# Altium project main.PrjPCB
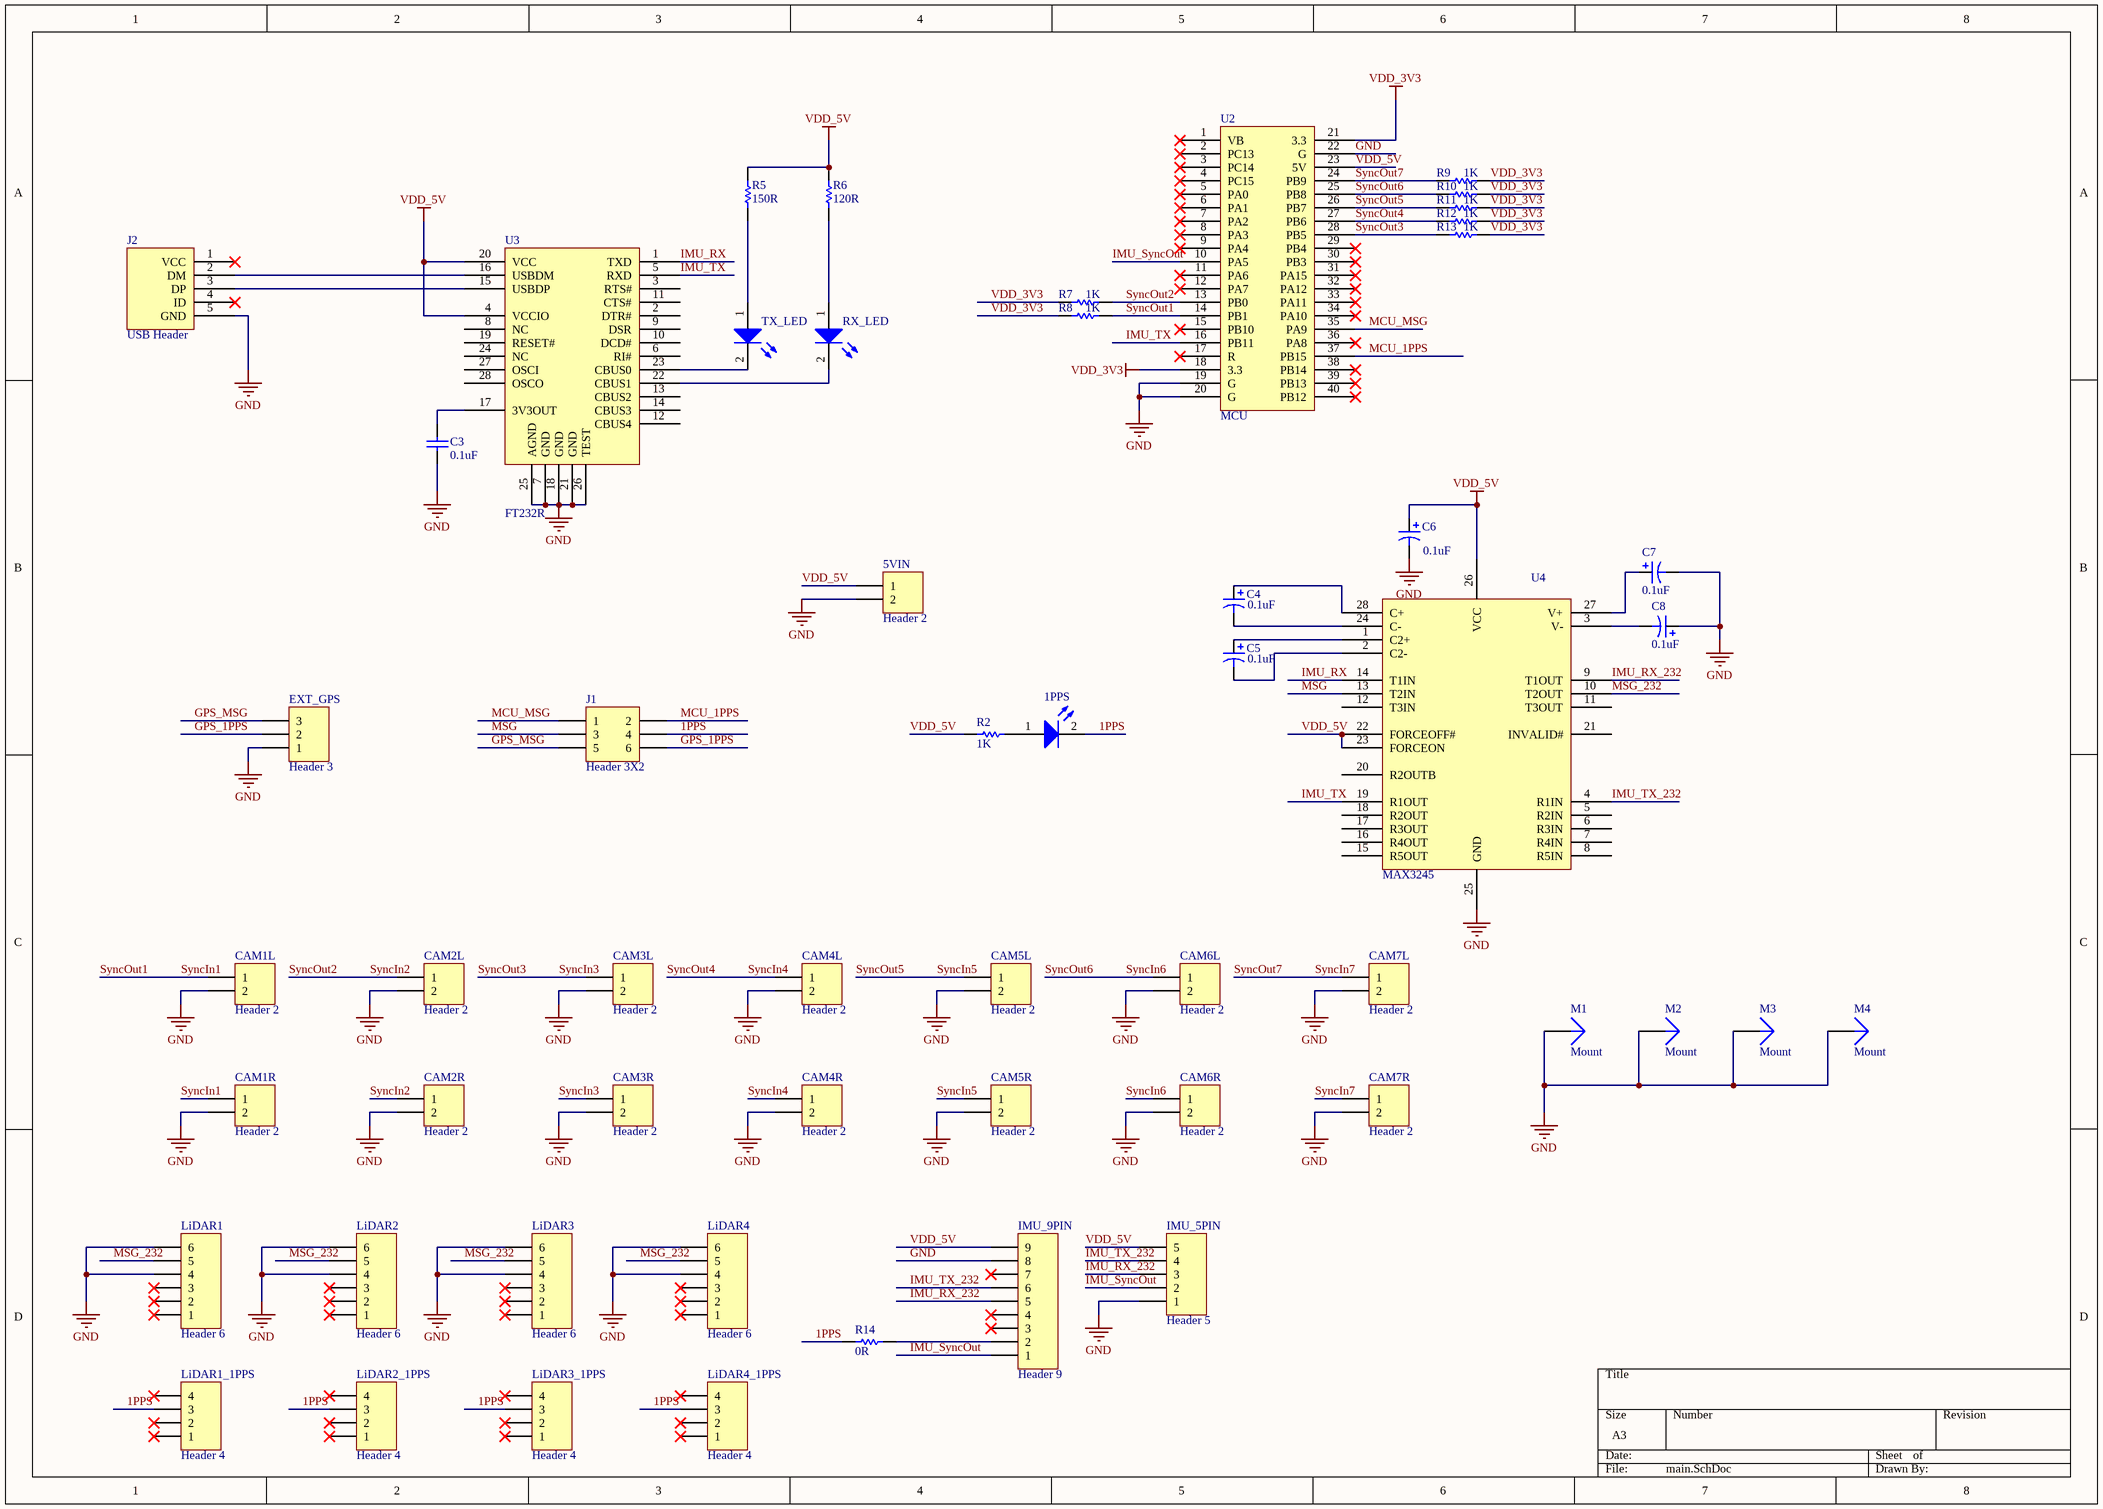
[diagram p0: main.SchDoc]
1 sheet, 55 parts. Net scope: global (net labels, ports and power ports of the same name join across sheets).
Board file: main.PcbDoc

## Sheet main.SchDoc
size A3

### Parts
1PPS  1PPS LED  [0805D]  (value not drawn)
5VIN  Header 2  [HDR1X2]
C3  0.1uF  [0805C]
C4  0.1uF  [C1206]
C5  0.1uF  [C1206]
C6  0.1uF  [C1206]
C7  0.1uF  [C1206]
C8  0.1uF  [C1206]
CAM1L  Header 2  [1.25mmP2]
CAM1R  Header 2  [1.25mmP2]
CAM2L  Header 2  [1.25mmP2]
CAM2R  Header 2  [1.25mmP2]
CAM3L  Header 2  [1.25mmP2]
CAM3R  Header 2  [1.25mmP2]
CAM4L  Header 2  [1.25mmP2]
CAM4R  Header 2  [1.25mmP2]
CAM5L  Header 2  [1.25mmP2]
CAM5R  Header 2  [1.25mmP2]
CAM6L  Header 2  [1.25mmP2]
CAM6R  Header 2  [1.25mmP2]
CAM7L  Header 2  [1.25mmP2]
CAM7R  Header 2  [1.25mmP2]
EXT_GPS  Header 3  [1.25mmP3]
IMU_5PIN  Header 5  [1.25mmP5]
IMU_9PIN  Header 9  [1.25mmP9]
J1  Header 3X2  [HDR2X3]
J2  USB Header  [USB2.5-2H4D]
LiDAR1  Header 6  [1.25mmP6]
LiDAR1_1PPS  Header 4  [1.25mmP4]
LiDAR2  Header 6  [1.25mmP6]
LiDAR2_1PPS  Header 4  [1.25mmP4]
LiDAR3  Header 6  [1.25mmP6]
LiDAR3_1PPS  Header 4  [1.25mmP4]
LiDAR4  Header 6  [1.25mmP6]
LiDAR4_1PPS  Header 4  [1.25mmP4]
M1  Mount  [安装孔-3.5-5]
M2  Mount  [安装孔-3.5-5]
M3  Mount  [安装孔-3.5-5]
M4  Mount  [安装孔-3.5-5]
R2  1K  [0805R]
R5  150R  [0805R]
R6  120R  [0805R]
R7  1K  [0805R]
R8  1K  [0805R]
R9  1K  [0805R]
R10  1K  [0805R]
R11  1K  [0805R]
R12  1K  [0805R]
R13  1K  [0805R]
R14  0R  [0805R]
RX_LED  USB RX LED  [0805D]  (value not drawn)
TX_LED  USB TX LED  [0805D]  (value not drawn)
U2  MCU  [STM32Board]
U3  FT232R  [SSOP-28]
U4  MAX3245  [SSOP-28]

### Nets
GND: 5VIN.2 C3.1 C6.2 C7.2 C8.1 CAM1L.2 CAM1R.2 CAM2L.2 CAM2R.2 CAM3L.2 CAM3R.2 CAM4L.2 CAM4R.2 CAM5L.2 CAM5R.2 CAM6L.2 CAM6R.2 CAM7L.2 CAM7R.2 EXT_GPS.1 IMU_5PIN.1 IMU_9PIN.8 J2.5(GND) LiDAR1.4 LiDAR1.6 LiDAR2.4 LiDAR2.6 LiDAR3.4 LiDAR3.6 LiDAR4.4 LiDAR4.6 M1.1 M2.1 M3.1 M4.1 U2.19(G) U2.20(G) U2.22(G) U3.7(GND) U3.18(GND) U3.21(GND) U3.25(AGND) U3.26(TEST) U4.25(GND)
VDD_3V3: R7.2 R8.2 R9.1 R10.1 R11.1 R12.1 R13.1 U2.18(3.3) U2.21(3.3)
VDD_5V: 5VIN.1 C6.1 IMU_5PIN.5 IMU_9PIN.9 R2.2 R5.1 R6.1 U2.23(5V) U3.4(VCCIO) U3.20(VCC) U4.22(FORCEOFF#) U4.23(FORCEON) U4.26(VCC)
1PPS: 1PPS.2(K) J1.4 LiDAR1_1PPS.3 LiDAR2_1PPS.3 LiDAR3_1PPS.3 LiDAR4_1PPS.3 R14.1
GPS_1PPS: EXT_GPS.2 J1.6
GPS_MSG: EXT_GPS.3 J1.5
IMU_RX: U3.1(TXD) U4.14(T1IN)
IMU_RX_232: IMU_5PIN.3 IMU_9PIN.5 U4.9(T1OUT)
IMU_SyncOut: IMU_5PIN.2 IMU_9PIN.1 U2.10(PA5)
IMU_TX: U2.16(PB11) U3.5(RXD) U4.19(R1OUT)
IMU_TX_232: IMU_5PIN.4 IMU_9PIN.6 U4.4(R1IN)
MCU_1PPS: J1.2 U2.37(PB15)
MCU_MSG: J1.1 U2.35(PA9)
MSG: J1.3 U4.13(T2IN)
MSG_232: LiDAR1.5 LiDAR2.5 LiDAR3.5 LiDAR4.5 U4.10(T2OUT)
SyncIn1: CAM1L.1 CAM1R.1 R8.1 U2.14(PB1)  [also labelled SyncOut1]
SyncIn2: CAM2L.1 CAM2R.1 R7.1 U2.13(PB0)  [also labelled SyncOut2]
SyncIn3: CAM3L.1 CAM3R.1 R13.2 U2.28(PB5)  [also labelled SyncOut3]
SyncIn4: CAM4L.1 CAM4R.1 R12.2 U2.27(PB6)  [also labelled SyncOut4]
SyncIn5: CAM5L.1 CAM5R.1 R11.2 U2.26(PB7)  [also labelled SyncOut5]
SyncIn6: CAM6L.1 CAM6R.1 R10.2 U2.25(PB8)  [also labelled SyncOut6]
SyncIn7: CAM7L.1 CAM7R.1 R9.2 U2.24(PB9)  [also labelled SyncOut7]
Net1PPS_1: 1PPS.1(A) R2.1
NetC3_2: C3.2 U3.17(3V3OUT)
NetC4_1: C4.1 U4.28(C+)
NetC4_2: C4.2 U4.24(C-)
NetC5_1: C5.1 U4.1(C2+)
NetC5_2: C5.2 U4.2(C2-)
NetC7_1: C7.1 U4.27(V+)
NetC8_2: C8.2 U4.3(V-)
NetIMU_9PIN_2: IMU_9PIN.2 R14.2
NetJ2_2: J2.2(DM) U3.16(USBDM)
NetJ2_3: J2.3(DP) U3.15(USBDP)
NetR5_2: R5.2 TX_LED.1(A)
NetR6_2: R6.2 RX_LED.1(A)
NetRX_LED_2: RX_LED.2(K) U3.22(CBUS1)
NetTX_LED_2: TX_LED.2(K) U3.23(CBUS0)

Not connected (* = marked no-connect by the designer): IMU_9PIN 3* 4* 7*; J2 1(VCC)* 4(ID)*; LiDAR1 1* 2* 3*; LiDAR1_1PPS 1* 2* 4*; LiDAR2 1* 2* 3*; LiDAR2_1PPS 1* 2* 4*; LiDAR3 1* 2* 3*; LiDAR3_1PPS 1* 2* 4*; LiDAR4 1* 2* 3*; LiDAR4_1PPS 1* 2* 4*; U2 1(VB)* 2(PC13)* 3(PC14)* 4(PC15)* 5(PA0)* 6(PA1)* 7(PA2)* 8(PA3)* 9(PA4)* 11(PA6)* 12(PA7)* 15(PB10)* 17(R)* 29(PB4)* 30(PB3)* 31(PA15)* 32(PA12)* 33(PA11)* 34(PA10)* 36(PA8)* 38(PB14)* 39(PB13)* 40(PB12)*; U3 2(DTR#) 3(RTS#) 6(RI#) 8(NC) 9(DSR) 10(DCD#) 11(CTS#) 12(CBUS4) 13(CBUS2) 14(CBUS3) 19(RESET#) 24(NC) 27(OSCI) 28(OSCO); U4 5(R2IN) 6(R3IN) 7(R4IN) 8(R5IN) 11(T3OUT) 12(T3IN) 15(R5OUT) 16(R4OUT) 17(R3OUT) 18(R2OUT) 20(R2OUTB) 21(INVALID#)

### Library data of the parts
1PPS = LED2: BLUE; Manufacturer: Generic Components; Class: Optoelectronic; Published: 08/06/2000; Publisher: Altium Hobart Technology Centre; SubClass: LED
5VIN CAM1L CAM1R CAM2L CAM2R CAM3L CAM3R CAM4L CAM4R CAM5L CAM5R CAM6L CAM6R CAM7L CAM7R = Header 2: Header, 2-Pin; LatestRevisionDate: 17-Jul-2002; LatestRevisionNote: Re-released for DXP Platform.; Publisher: Altium Limited
C3 = Cap: Capacitor; Published: 8-Jun-2000; LatestRevisionDate: 17-Jul-2002; LatestRevisionNote: Re-released for DXP Platform.; Publisher: Altium Limited; Value: 0.1uF
C4-C8 = Cap Pol3: Polarized Capacitor (Surface Mount); Published: 8-Jun-2000; LatestRevisionDate: 17-Jul-2002; LatestRevisionNote: Re-released for DXP Platform.; PackageReference: C0805; Publisher: Altium Limited
EXT_GPS = Header 3: Header, 3-Pin; LatestRevisionDate: 17-Jul-2002; LatestRevisionNote: Re-released for DXP Platform.; Publisher: Altium Limited
IMU_5PIN = Header 5: Header, 5-Pin; LatestRevisionDate: 17-Jul-2002; LatestRevisionNote: Re-released for DXP Platform.; Publisher: Altium Limited
IMU_9PIN = Header 9: Header, 9-Pin; LatestRevisionDate: 17-Jul-2002; LatestRevisionNote: Re-released for DXP Platform.; Publisher: Altium Limited
J1 = Header 3X2: Header, 3-Pin, Dual row; LatestRevisionDate: 17-Jul-2002; LatestRevisionNote: Re-released for DXP Platform.; Publisher: Altium Limited
J2 = USB
LiDAR1-LiDAR4 = Header 6: Header, 6-Pin; LatestRevisionDate: 17-Jul-2002; LatestRevisionNote: Re-released for DXP Platform.; Publisher: Altium Limited
LiDAR1_1PPS LiDAR2_1PPS LiDAR3_1PPS LiDAR4_1PPS = Header 4: Header, 4-Pin; LatestRevisionDate: 17-Jul-2002; LatestRevisionNote: Re-released for DXP Platform.; Publisher: Altium Limited
M1-M4 = Plug: LatestRevisionDate: 17-Jul-2002; LatestRevisionNote: Re-released for DXP Platform.; Publisher: Altium Limited
R2 R5-R14 = Res1: Resistor; Manufacturer: Generic Components; Class: Passive; Published: 08/06/2000; Publisher: Altium Hobart Technology Centre; SubClass: Resistor
  R2 R7-R13: Value: 1K
  R5: Value: 150R
  R6: Value: 120R
  R14: Value: 0R
RX_LED = LED2: GREEN; Manufacturer: Generic Components; Class: Optoelectronic; Published: 08/06/2000; Publisher: Altium Hobart Technology Centre; SubClass: LED
TX_LED = LED2: YELLOW; Manufacturer: Generic Components; Class: Optoelectronic; Published: 08/06/2000; Publisher: Altium Hobart Technology Centre; SubClass: LED